# EAGLE schematic 8ChannelRebelSSR_v5 (EAGLE 9.6.2)
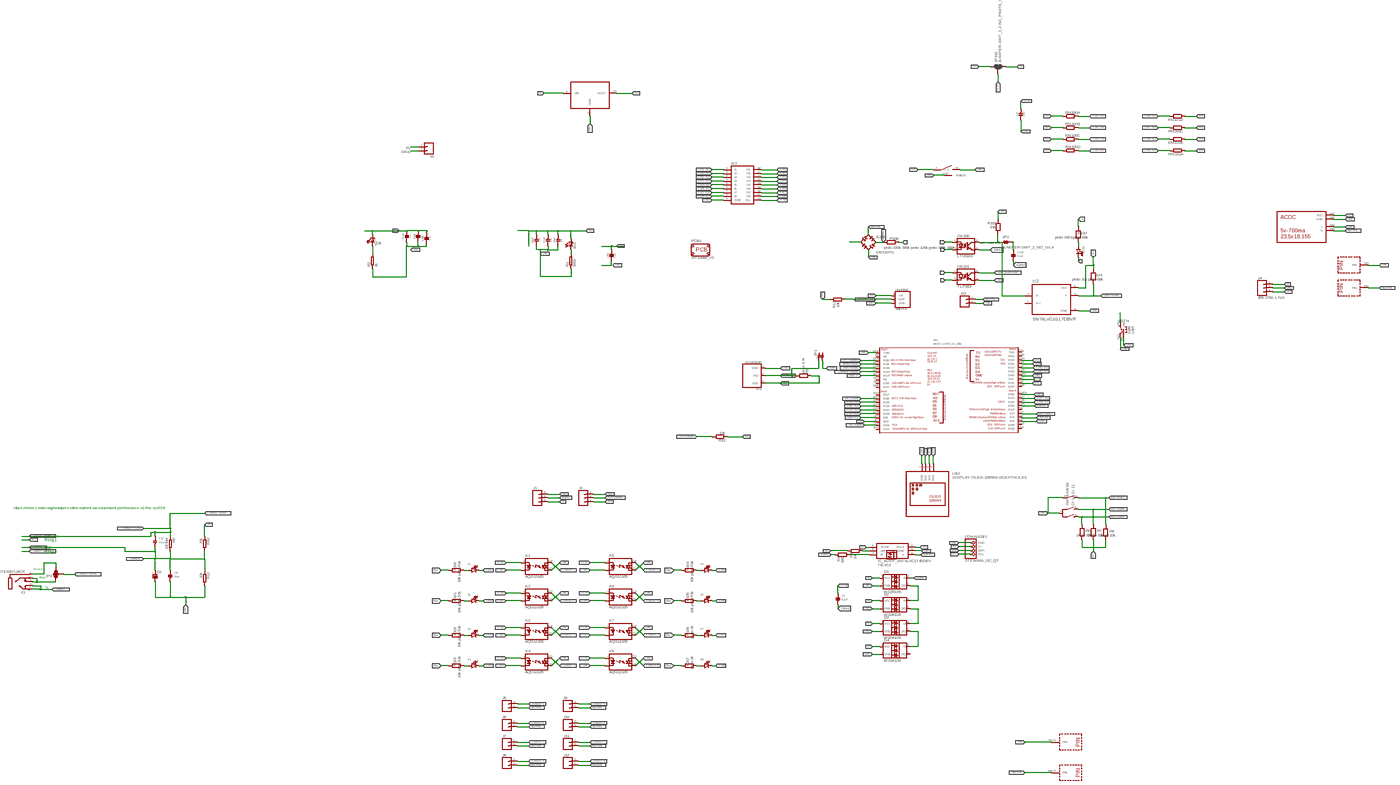
[diagram p0: schematic, sheet 1, overview]
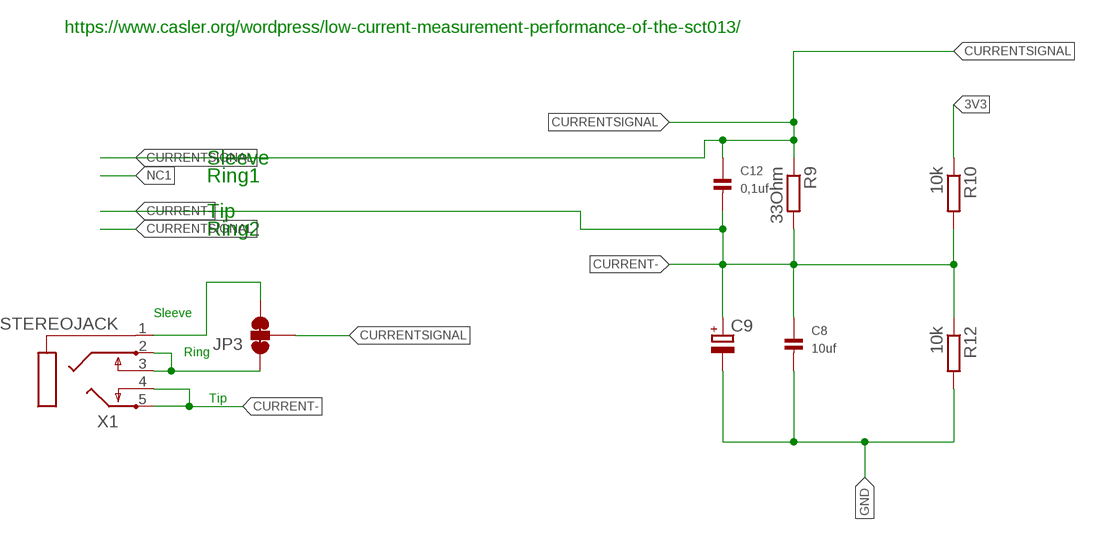
[diagram p1: schematic, sheet 1, part 1 of 4]
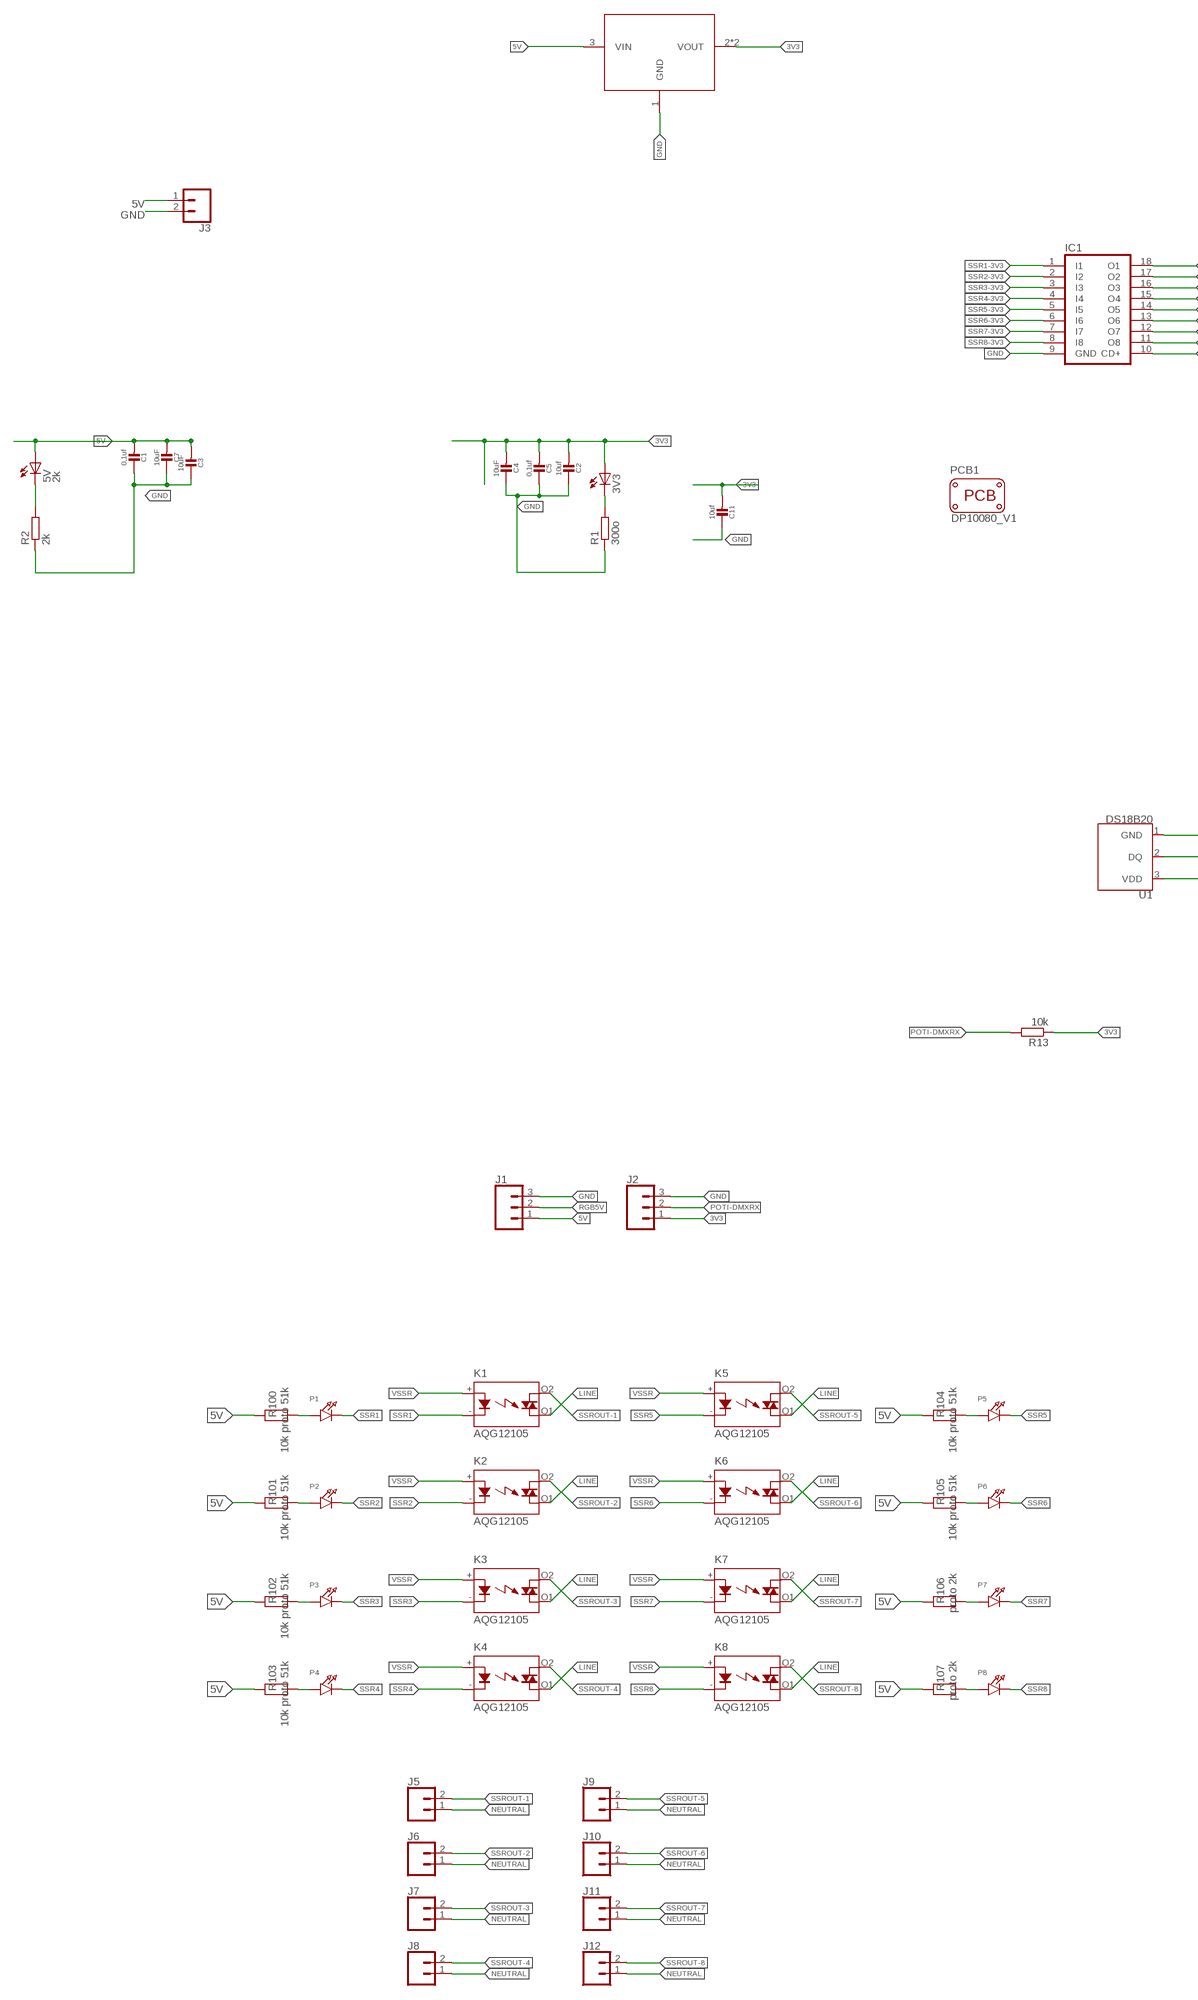
[diagram p2: schematic, sheet 1, part 2 of 4]
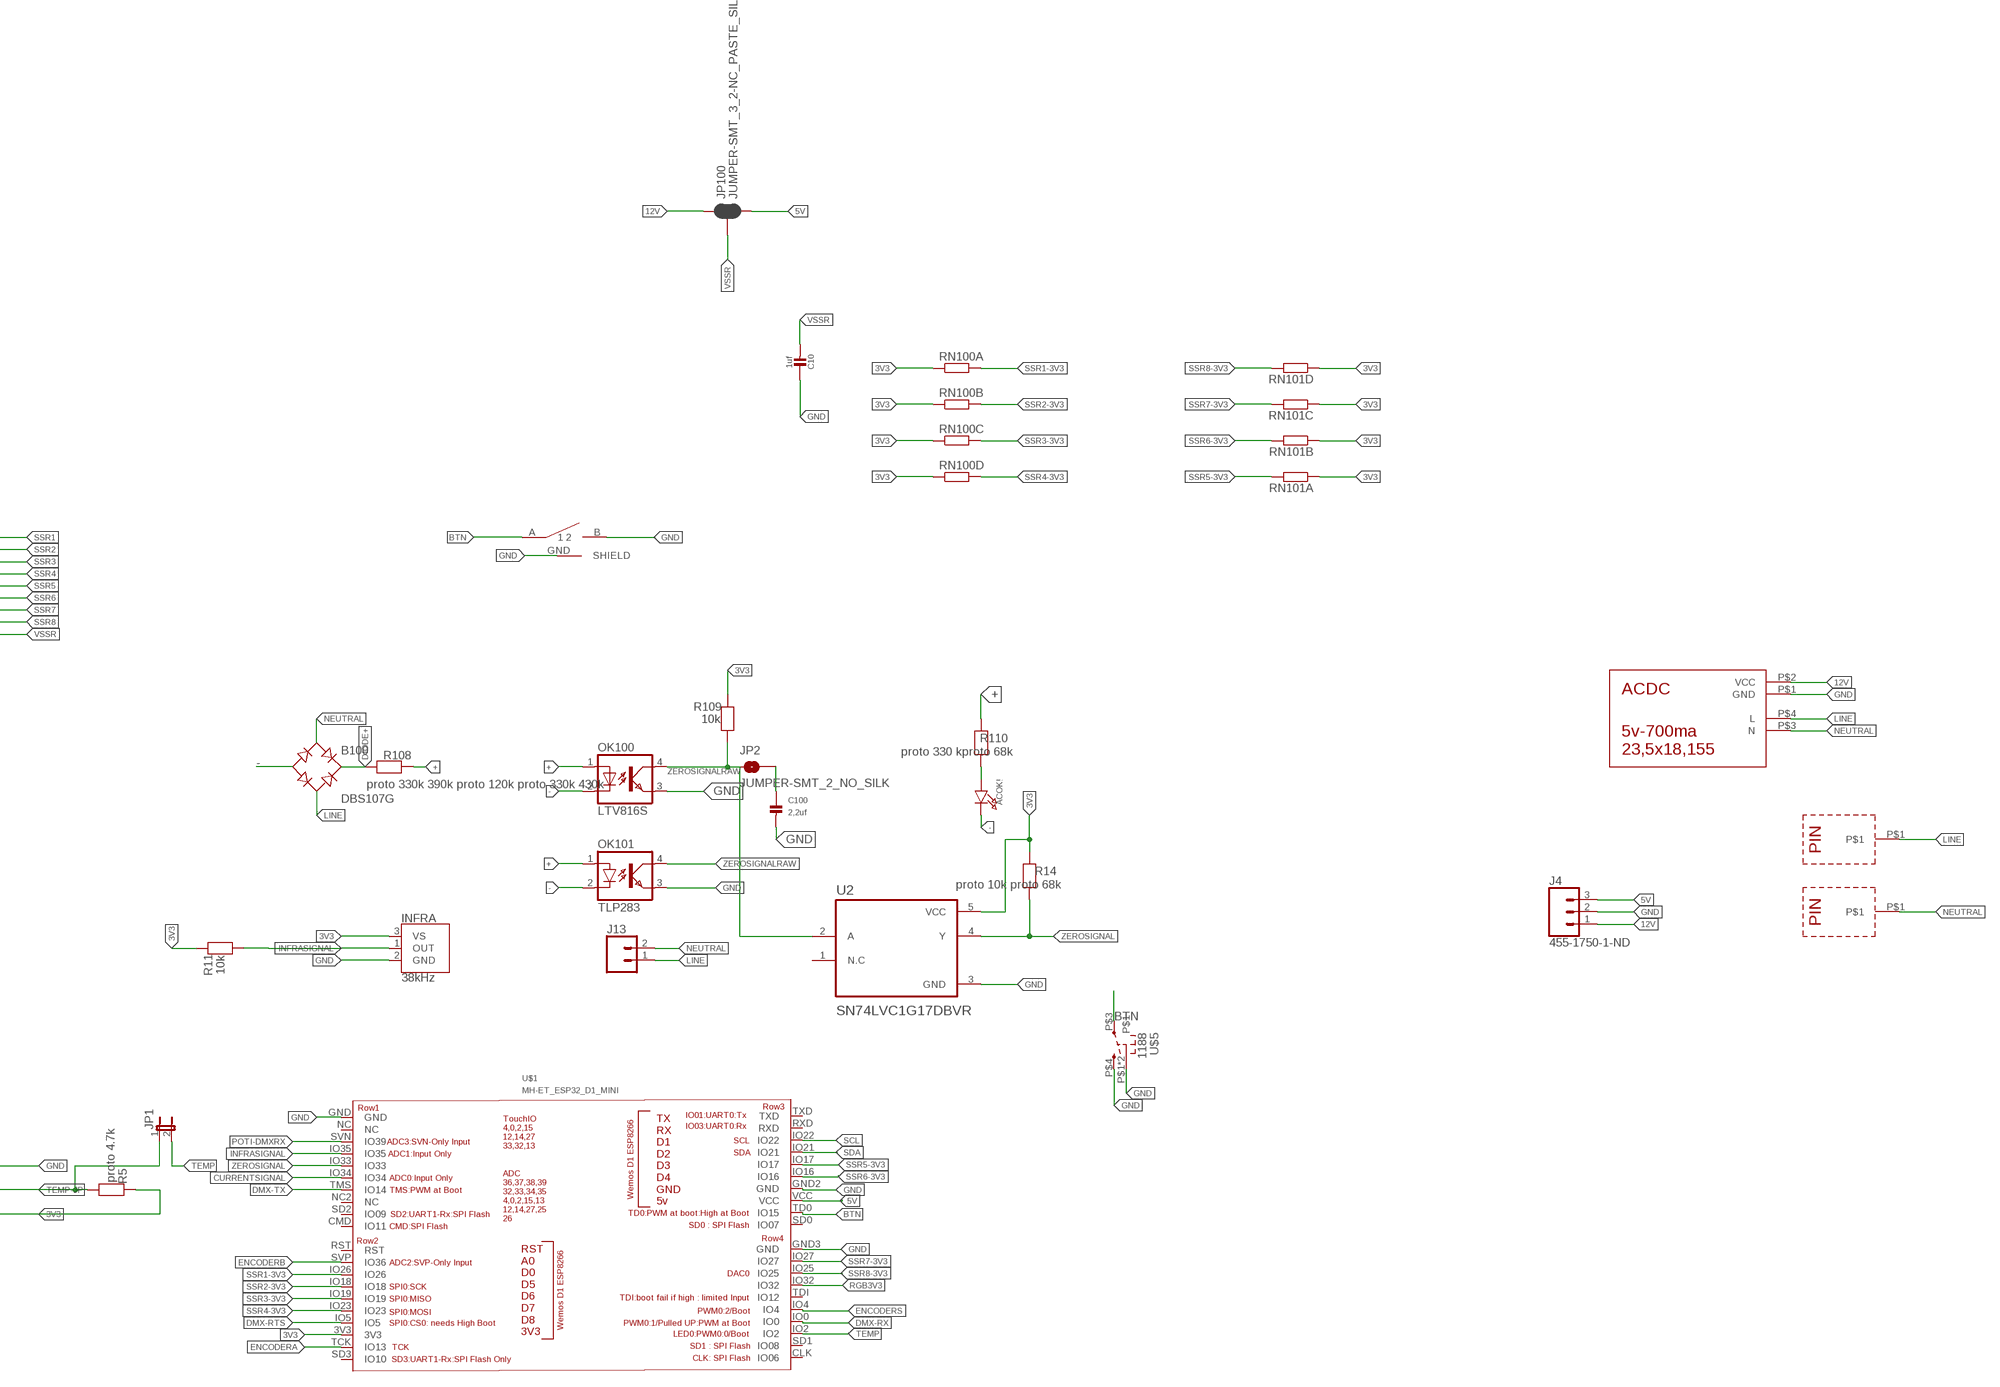
[diagram p3: schematic, sheet 1, part 3 of 4]
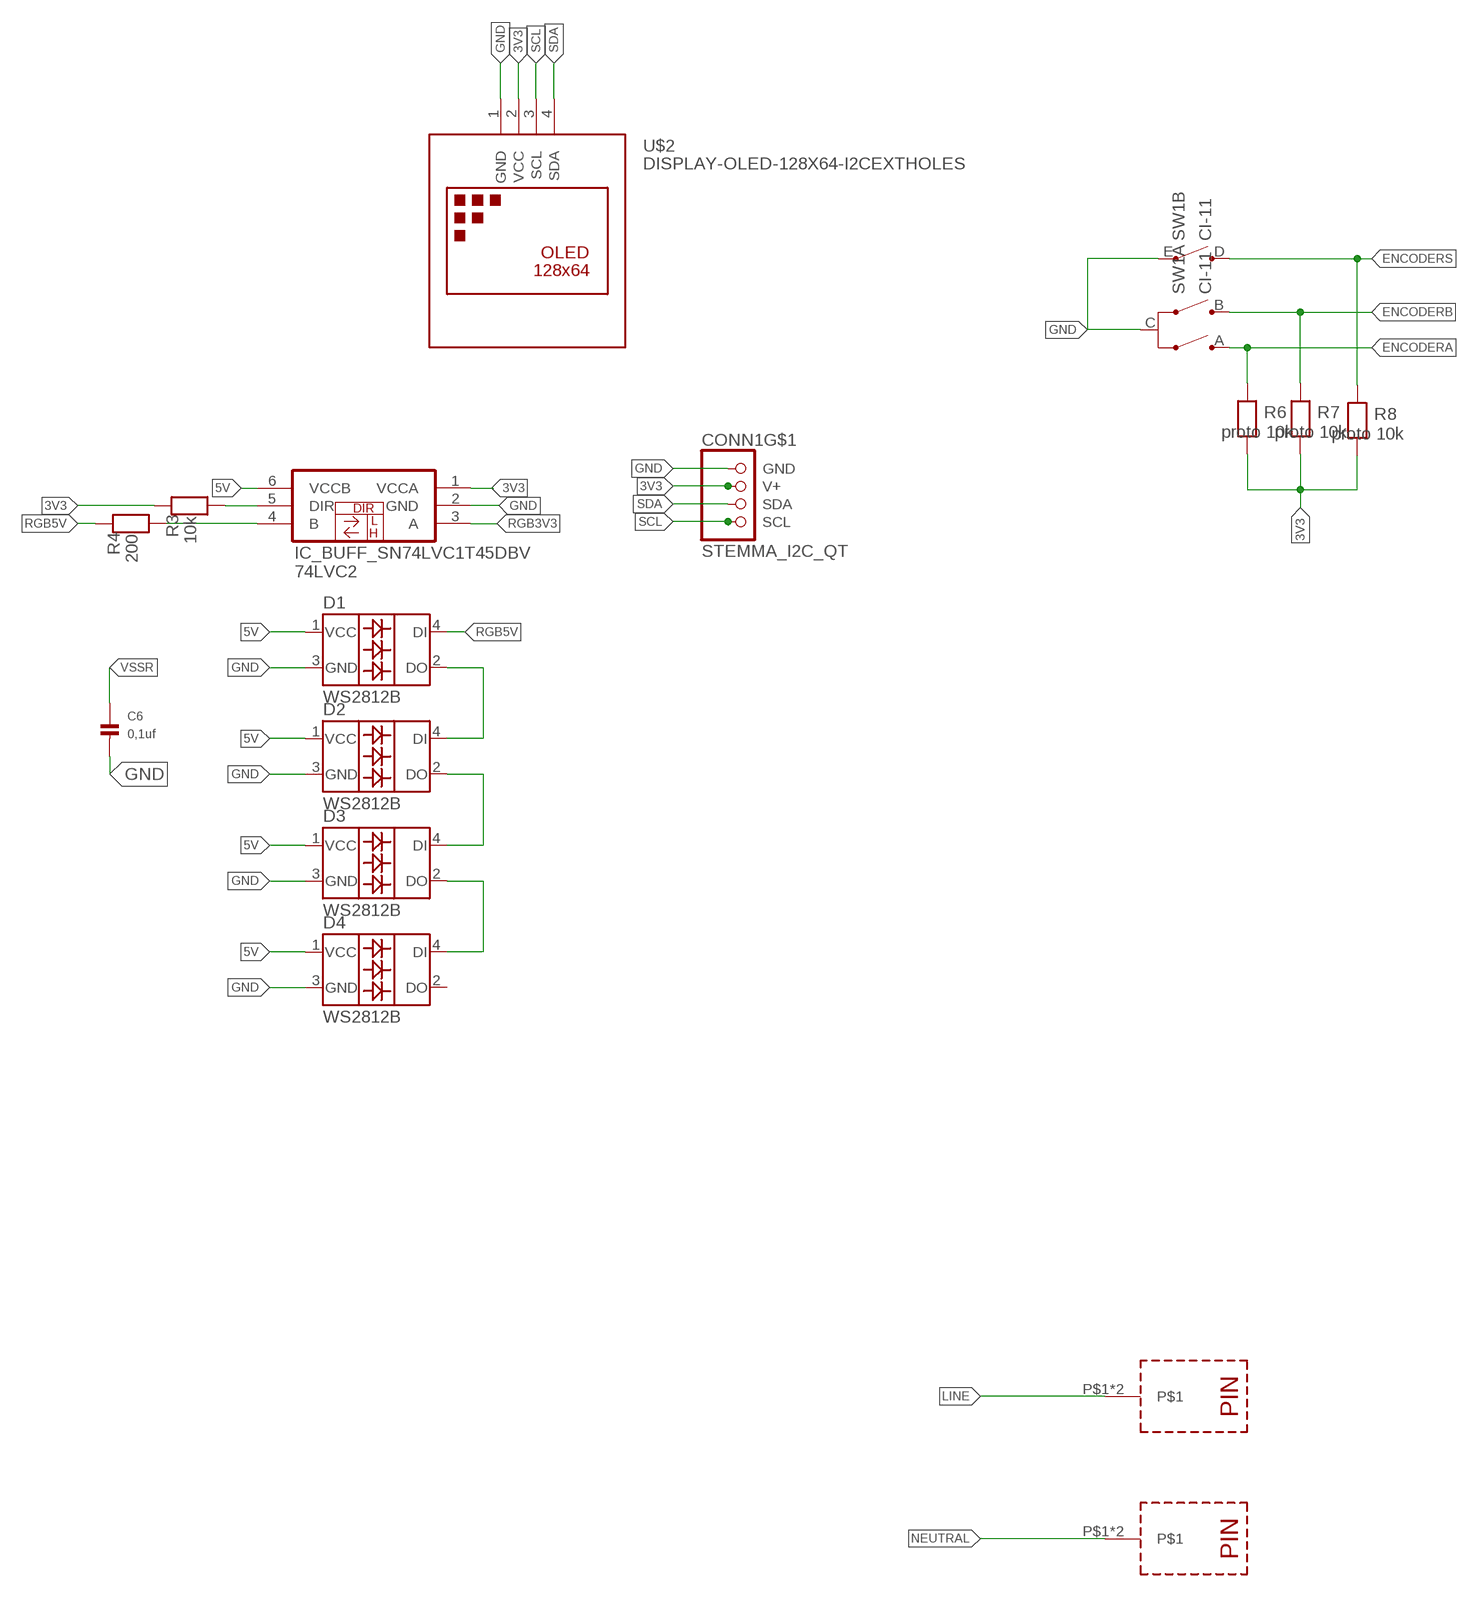
[diagram p4: schematic, sheet 1, part 4 of 4]

## Parts
3V3  LEDCHIPLED_0805  [CHIPLED_0805]
5V  2k  LEDCHIPLED_0805  [CHIPLED_0805]
74LVC2  IC_BUFF_SN74LVC1T45DBV  [DBV-R-PDSO-G6]
ACOK!  LED0805  [CHIPLED_0805]
B100  DBS107G  [DBS]
C1  0,1uf  CAP_CERAMIC0805-NOOUTLINE  [0805-NO]
C2  10uf  CAP_CERAMIC0805-NOOUTLINE  [0805-NO]
C3  10uF  CAP_CERAMIC0805-NOOUTLINE  [0805-NO]
C4  10uF  CAP_CERAMIC0805-NOOUTLINE  [0805-NO]
C5  0,1uf  CAP_CERAMIC0805-NOOUTLINE  [0805-NO]
C6  0,1uf  CAP_CERAMIC0805-NOTHERMALS  [0805_NOTHERMALS@1]
C7  10uF  CAP_CERAMIC0805-NOOUTLINE  [0805-NO]
C8  10uf  CAP_CERAMIC0805-NOTHERMALS  [0805_NOTHERMALS@1]
C9  CPOL-EUE1.8-4  [E1,8-4]
C10  1uf  CAP_CERAMIC0805-NOOUTLINE  [0805-NO]
C11  10uf  CAP_CERAMIC0805-NOOUTLINE  [0805-NO]
C12  0,1uf  CAP_CERAMIC0805-NOTHERMALS  [0805_NOTHERMALS@1]
C100  2,2uf  CAP_CERAMIC0805-NOTHERMALS  [0805_NOTHERMALS@1]
CONN1  STEMMA_I2C_QT  [JST_SH4]
D1  WS2812B  [WS2812B]
D2  WS2812B  [WS2812B]
D3  WS2812B  [WS2812B]
D4  WS2812B  [WS2812B]
IC1  IC_ULN2803ADW  [SO-18L]
INFRA  38kHz  TSOP38238  [TSOP382]
J1  CONN_03POLAR  [MOLEX-1X3]
J2  CONN_03POLAR  [MOLEX-1X3]
J3  CONN_02POLAR  [MOLEX-1X2]
J4  455-1750-1-ND  CONN_03  [1X03]
J5  CONN_023.5MM  [SCREWTERMINAL-3.5MM-2]
J6  CONN_023.5MM  [SCREWTERMINAL-3.5MM-2]
J7  CONN_023.5MM  [SCREWTERMINAL-3.5MM-2]
J8  CONN_023.5MM  [SCREWTERMINAL-3.5MM-2]
J9  CONN_023.5MM  [SCREWTERMINAL-3.5MM-2]
J10  CONN_023.5MM  [SCREWTERMINAL-3.5MM-2]
J11  CONN_023.5MM  [SCREWTERMINAL-3.5MM-2]
J12  CONN_023.5MM  [SCREWTERMINAL-3.5MM-2]
J13  CONN_023.5MM  [SCREWTERMINAL-3.5MM-2]
JP1  JUMPER2  [JUMPER2]
JP2  JUMPER-SMT_2_NO_SILK  [SMT-JUMPER_2_NO_SILK]
JP3  JUMPER-PAD-3-NC_BY_TRACE  [PAD-JUMPER-3-3OF3_NC_BY_TRACE_YES_SILK_FULL_BOX]
JP100  JUMPER-SMT_3_2-NC_PASTE_SILK  [SMT-JUMPER_3_2-NC_PASTE_SILK]
K1  AQG12105  [AQG]
K2  AQG12105  [AQG]
K3  AQG12105  [AQG]
K4  AQG12105  [AQG]
K5  AQG12105  [AQG]
K6  AQG12105  [AQG]
K7  AQG12105  [AQG]
K8  AQG12105  [AQG]
OK100  LTV816S  [DIL4-SMD]
OK101  TLP283  [MINI-FLAT-4]
P1  LED0805  [CHIPLED_0805]
P2  LED0805  [CHIPLED_0805]
P3  LED0805  [CHIPLED_0805]
P4  LED0805  [CHIPLED_0805]
P5  LED0805  [CHIPLED_0805]
P6  LED0805  [CHIPLED_0805]
P7  LED0805  [CHIPLED_0805]
P8  LED0805  [CHIPLED_0805]
PCB1  PCB_DP_RECTANGLE-80X100  [DP10080_V1]
R1  300o  RESISTORR805-0805  [R805]
R2  2k  RESISTORR805-0805  [R805]
R3  10k  RESISTOR0805  [0805@1]
R4  200  RESISTOR0805  [0805@1]
R5  proto 4.7k  RESISTOR0805  [0805@1]
R6  proto 10k  RESISTOR0805  [0805@1]
R7  proto 10k  RESISTOR0805  [0805@1]
R8  proto 10k  RESISTOR0805  [0805@1]
R9  33Ohm  RESISTORR805-0805  [R805]
R10  10k  RESISTORR805-0805  [R805]
R11  10k  RESISTOR0805  [0805@1]
R12  10k  RESISTORR805-0805  [R805]
R13  10k  RESISTORR805-0805  [R805]
R14  proto 10k proto 68k  RESISTOR0805  [0805@1]
R100  10k proto 51k  RESISTOR0805  [0805@1]
R101  10k proto 51k  RESISTOR0805  [0805@1]
R102  10k proto 51k  RESISTOR0805  [0805@1]
R103  10k proto 51k  RESISTOR0805  [0805@1]
R104  10k proto 51k  RESISTOR0805  [0805@1]
R105  10k proto 51k  RESISTOR0805  [0805@1]
R106  proto 2k  RESISTOR0805  [0805@1]
R107  proto 2k  RESISTOR0805  [0805@1]
R108  proto 330k 390k proto 120k proto 330k 430k  RESISTOR0805  [0805@1]
R109  10k  RESISTOR0805  [0805@1]
R110  proto 330 kproto 68k  RESISTOR0805  [0805@1]
RN100  RESISTOR_ARRAY_4  [RN8P-4R-CRA06S]
RN101  RESISTOR_ARRAY_4  [RN8P-4R-CRA06S]
SW1  CI-11  [CI-11]
U1  DS18B20  [TO-92-AMMO]
U2  SN74LVC1G17DBVR  [SOT95P280X145-5N]
U$1  MH-ET_ESP32_D1_MINI  [MH-ET_ESP32_D1_MINI]
U$2  DISPLAY-OLED-128X64-I2CEXTHOLES  [DISPLAY-OLED-128X64-MAX-I2C]
U$4  SWITCH4.5-4,5  [SWITCH4.5X4.5]
U$5  1188  [1188]
U$6  AP11173V3  [SOT223]
U$7  ACDC-SUPPLY  [ACDC-5V]
U$15  EST026_COLDPRESSTERMINAL  [EST026-COLDPRESSTERMINAL]
U$16  SCREWTERMINAL_BLOCL5X5_FLAT  [SCREWTERMINALFLAT5X5]
U$17  EST026_COLDPRESSTERMINAL  [EST026-COLDPRESSTERMINAL]
U$18  SCREWTERMINAL_BLOCL5X5_FLAT  [SCREWTERMINALFLAT5X5]
X1  STEREOJACK  [STX3100]

## Nets
3V3: 3V3.A 74LVC2.1(VCCA) C2.2 C4.2 C5.2 C11.2 CONN1.2(V+) INFRA.3(VS) J2.1 R3.2 R5.2 R6.1 R7.1 R8.1 R10.1 R11.2 R13.1 R14.2 R109.2 RN100.1 RN100.2 RN100.3 RN100.4 RN101.1 RN101.2 RN101.3 RN101.4 U1.3(VDD) U2.5(VCC) U$1.3V3 U$2.2(VCC) U$6.2(VOUT) U$6.4(VOUT)
5V: 5V.A 74LVC2.6(VCCB) C1.2 C3.2 C7.2 D1.1(VCC) D2.1(VCC) D3.1(VCC) D4.1(VCC) J1.1 J3.1 J4.3 JP100.3 R100.2 R101.2 R102.2 R103.2 R104.2 R105.2 R106.2 R107.2 U$1.VCC U$6.3(VIN)
12V: J4.1 JP100.1 U$7.P$2(VCC)
+: OK100.1(A) OK101.1(A) R108.2 R110.2
-: ACOK!.C B100.- OK100.2(C) OK101.2(C)
BTN: U$1.TD0(IO15) U$4.A U$5.P$3
CURRENT-: C8.1 C9.+ C12.2 R9.2 R10.2 R12.1 X1.4 X1.5
CURRENTSIGNAL: C12.1 JP3.2 R9.1 U$1.IO34
DIODE+: B100.+ R108.1
DMX-RTS: U$1.IO5
DMX-RX: U$1.IO0
DMX-TX: U$1.TMS(IO14)
ENCODERA: R6.2 SW1.A(A:A) U$1.TCK(IO13)
ENCODERB: R7.2 SW1.B(A:B) U$1.SVP(IO36)
ENCODERS: R8.2 SW1.D(B:D) U$1.IO4
GND: 74LVC2.2(GND) C1.1 C2.1 C3.1 C4.1 C5.1 C6.2 C7.1 C8.2 C9.- C10.1 C11.1 C100.2 CONN1.1(GND) D1.3(GND) D2.3(GND) D3.3(GND) D4.3(GND) IC1.9(GND) INFRA.2(GND) J1.3 J2.3 J3.2 J4.2 OK100.3(EMIT) OK101.3(EMIT) R1.1 R2.1 R12.2 SW1.C(A:C) SW1.E(B:E) U1.1(GND) U2.3(GND) U$1.GND U$1.GND2(GND) U$1.GND3(GND) U$2.1(GND) U$4.B U$4.GND(SHIELD) U$5.P$1 U$5.P$2 U$5.P$4 U$6.1(GND) U$7.P$1(GND)
INFRASIGNAL: INFRA.1(OUT) R11.1 U$1.IO35
LINE: B100.AC2 J13.1 K1.O1(DS2) K2.O1(DS2) K3.O1(DS2) K4.O1(DS2) K5.O1(DS2) K6.O1(DS2) K7.O1(DS2) K8.O1(DS2) U$7.P$4(L) U$15.P$1 U$15.P$2 U$16.P$1
N$1: C100.1 JP2.2
N$2: JP3.1 X1.2 X1.3
N$3: 74LVC2.5(DIR) R3.1
N$4: 74LVC2.4(B) R4.1
N$5: D1.2(DO) D2.4(DI)
N$6: D2.2(DO) D3.4(DI)
N$7: D3.2(DO) D4.4(DI)
N$8: ACOK!.A R110.1
N$9: 3V3.C R1.2
N$10: 5V.C R2.2
N$13: P4.A R103.1
N$14: P3.A R102.1
N$16: P2.A R101.1
N$17: P1.A R100.1
N$18: P8.A R107.1
N$19: P7.A R106.1
N$20: P6.A R105.1
N$21: P5.A R104.1
NEUTRAL: B100.AC1 J5.1 J6.1 J7.1 J8.1 J9.1 J10.1 J11.1 J12.1 J13.2 U$7.P$3(N) U$17.P$1 U$17.P$2 U$18.P$1
OLDSIGNAL1: JP3.3 X1.1
POTI-DMXRX: J2.2 R13.2 U$1.SVN(IO39)
RGB3V3: 74LVC2.3(A) U$1.IO32
RGB5V: D1.4(DI) J1.2 R4.2
SCL: CONN1.4(SCL) U$1.IO22 U$2.3(SCL)
SDA: CONN1.3(SDA) U$1.IO21 U$2.4(SDA)
SSR1: IC1.18(O1) K1.-(K) P1.C
SSR1-3V3: IC1.1(I1) RN100.8 U$1.IO26
SSR2: IC1.17(O2) K2.-(K) P2.C
SSR2-3V3: IC1.2(I2) RN100.7 U$1.IO18
SSR3: IC1.16(O3) K3.-(K) P3.C
SSR3-3V3: IC1.3(I3) RN100.6 U$1.IO19
SSR4: IC1.15(O4) K4.-(K) P4.C
SSR4-3V3: IC1.4(I4) RN100.5 U$1.IO23
SSR5: IC1.14(O5) K5.-(K) P5.C
SSR5-3V3: IC1.5(I5) RN101.8 U$1.IO17
SSR6: IC1.13(O6) K6.-(K) P6.C
SSR6-3V3: IC1.6(I6) RN101.7 U$1.IO16
SSR7: IC1.12(O7) K7.-(K) P7.C
SSR7-3V3: IC1.7(I7) RN101.6 U$1.IO27
SSR8: IC1.11(O8) K8.-(K) P8.C
SSR8-3V3: IC1.8(I8) RN101.5 U$1.IO25
SSROUT-1: J5.2 K1.O2(DS1)
SSROUT-2: J6.2 K2.O2(DS1)
SSROUT-3: J7.2 K3.O2(DS1)
SSROUT-4: J8.2 K4.O2(DS1)
SSROUT-5: J9.2 K5.O2(DS1)
SSROUT-6: J10.2 K6.O2(DS1)
SSROUT-7: J11.2 K7.O2(DS1)
SSROUT-8: J12.2 K8.O2(DS1)
TEMP: JP1.2 U$1.IO2
TEMP-JP: JP1.1 R5.1 U1.2(DQ)
VSSR: C6.1 C10.2 IC1.10(CD+) JP100.2 K1.+(A) K2.+(A) K3.+(A) K4.+(A) K5.+(A) K6.+(A) K7.+(A) K8.+(A)
ZEROSIGNAL: R14.1 U2.4(Y) U$1.IO33
ZEROSIGNALRAW: JP2.1 OK100.4(COL) OK101.4(COL) R109.1 U2.2(A)
Unconnected: CONN1.MT1(MT) CONN1.MT2(MT) D4.2(DO) U2.1(N.C) U$1.CLK(IO06) U$1.CMD(IO11) U$1.NC U$1.NC2(NC) U$1.RST U$1.RXD U$1.SD0(IO07) U$1.SD1(IO08) U$1.SD2(IO09) U$1.SD3(IO10) U$1.TDI(IO12) U$1.TXD

## Notes on the sheet
- https://www.casler.org/wordpress/low-current-measurement-performance-of-the-sct013/
- Sleeve
- Ring1
- Tip
- Ring2
- Sleeve
- Ring
- Tip

## Library data of the parts
3V3 5V = adafruit:LED: LED
74LVC2 = dp_devices:IC_BUFF_SN74LVC1T45DBV
ACOK! P1-P8 = microbuilder:LED: LED
B100 = rectifier:DB?*G: Single Phase 1.0 AMP Glass Passivated Bridge Rectifier Taiwan Semiconductor Co.,Ltd. - TSC Source: http://www.taiwansemi.com/TSCbig5/ezcatfiles/cust/img/img/db101g.pdf http://www.ts.com.tw/db/pictures/modules/PDT/PDT060207001/DBLS201G.pdf
C1-C8 C10-C12 C100 = microbuilder:CAP_CERAMIC: Ceramic Capacitors For new designs, use the packages preceded by an '_' character since they are more reliable: The following footprints should be used on most boards: _0402 - Standard footprint for regular board layouts _0603 - Standard footprint for regular board layouts _0805 - Standard footprint for regular board layouts _1206 - Standard footprint for regular board layouts For extremely tight-pitch boards where space is at a premium, the following 'micro-pitch' footprints can be used (smaller pads, no silkscreen outline, etc.): _0402MP - Micro-pitch footprint for very dense/compact boards _0603MP - Micro-pitch footprint for very dense/compact boards _0805MP - Micro-pitch footprint for very dense/compact boards _1206MP - Micro-pitch footprint for very dense/compact boards
C9 = rcl:CPOL-EU: POLARIZED CAPACITOR, European symbol; SPICEPREFIX: C
CONN1 = microbuilder:STEMMA_I2C
D1-D4 = we-opto:WS2812B: WS2812 RGB LED (built-in driver)
IC1 = dp_devices:IC_ULN2803A: DRIVER ARRAY
INFRA = SparkFun-Sensors:TSOP382: Vishay Semiconductor TSOP32838 - 38kHz IR Receiver These products are miniaturized IR receiver modules for infrared remote control systems. A PIN diode and a preamplifier are assembled on a leadframe, the epoxy package contains an IR filter. The demodulated output signal can be directly connected to a microprocessor for decoding.; PROD_ID: SEN-14114
J1 J2 = SparkFun-Connectors:CONN_03: Multi connection point. Often used as Generic Header-pin footprint for 0.1 inch spaced/style header connections On any of the 0.1 inch spaced packages, you can populate with these: Break Away Headers - Straight <https://www.sparkfun.com/products/116> (PRT-00116) Break Away Male Headers - Right Angle <https://www.sparkfun.com/products/553> (PRT-00553) Female Headers <https://www.sparkfun.com/products/115> (PRT-00115) Break Away Headers - Machine Pin <https://www.sparkfun.com/products/117> (PRT-00117) Break Away Female Headers - Swiss Machine Pin <https://www.sparkfun.com/products/743> (PRT-00743) Stackable Header - 3 Pin (Female, 0.1") <https://www.sparkfun.com/products/13875> (PRT-13875) For SCREWTERMINALS and SPRING TERMINALS visit here: Screw Terimnals on SparkFun.com <https://www.sparkfun.com/search/results?term=Screw+Terminals> (5mm/3.5mm/2.54mm spacing) This device is also useful as a general connection point to wire up your design to another part of your project. Our various solder wires solder well into these plated through hole pads. Hook-Up Wire - Assortment (Stranded, 22 AWG) <https://www.sparkfun.com/products/11375> (PRT-11375) Hook-Up Wire - Assortment (Solid Core, 22 AWG) <https://www.sparkfun.com/products/11367> (PRT-11367) View the entire wire category on our website here <https://www.sparkfun.com/categories/141> Special notes: Molex polarized connector foot print use with SKU : PRT-08232 with associated crimp pins and housings.; PROD_ID: CONN-08625; SF_ID: PRT-08096
J3 = SparkFun-Connectors:CONN_02: Multi connection point. Often used as Generic Header-pin footprint for 0.1 inch spaced/style header connections On any of the 0.1 inch spaced packages, you can populate with these: Break Away Headers - Straight <https://www.sparkfun.com/products/116> (PRT-00116) Break Away Male Headers - Right Angle <https://www.sparkfun.com/products/553> (PRT-00553) Female Headers <https://www.sparkfun.com/products/115> (PRT-00115) Break Away Headers - Machine Pin <https://www.sparkfun.com/products/117> (PRT-00117) Break Away Female Headers - Swiss Machine Pin <https://www.sparkfun.com/products/743> (PRT-00743) For SCREWTERMINALS and SPRING TERMINALS visit here: Screw Terimnals on SparkFun.com <https://www.sparkfun.com/search/results?term=Screw+Terminals> (5mm/3.5mm/2.54mm spacing) This device is also useful as a general connection point to wire up your design to another part of your project. Our various solder wires solder well into these plated through hole pads. Hook-Up Wire - Assortment (Stranded, 22 AWG) <https://www.sparkfun.com/products/11375> (PRT-11375) Hook-Up Wire - Assortment (Solid Core, 22 AWG) <https://www.sparkfun.com/products/11367> (PRT-11367) View the entire wire category on our website here <https://www.sparkfun.com/categories/141> Special notes: Molex polarized connector foot print use with: PRT-08233 with associated crimp pins and housings. 2.54_SCREWTERM for use with PRT-10571. 3.5mm Screw Terminal footprints for PRT-08084 5mm Screw Terminal footprints for use with PRT-08432; SF_ID: PRT-09918
J4 = SparkFun-Connectors:CONN_03: Multi connection point. Often used as Generic Header-pin footprint for 0.1 inch spaced/style header connections On any of the 0.1 inch spaced packages, you can populate with these: Break Away Headers - Straight <https://www.sparkfun.com/products/116> (PRT-00116) Break Away Male Headers - Right Angle <https://www.sparkfun.com/products/553> (PRT-00553) Female Headers <https://www.sparkfun.com/products/115> (PRT-00115) Break Away Headers - Machine Pin <https://www.sparkfun.com/products/117> (PRT-00117) Break Away Female Headers - Swiss Machine Pin <https://www.sparkfun.com/products/743> (PRT-00743) Stackable Header - 3 Pin (Female, 0.1") <https://www.sparkfun.com/products/13875> (PRT-13875) For SCREWTERMINALS and SPRING TERMINALS visit here: Screw Terimnals on SparkFun.com <https://www.sparkfun.com/search/results?term=Screw+Terminals> (5mm/3.5mm/2.54mm spacing) This device is also useful as a general connection point to wire up your design to another part of your project. Our various solder wires solder well into these plated through hole pads. Hook-Up Wire - Assortment (Stranded, 22 AWG) <https://www.sparkfun.com/products/11375> (PRT-11375) Hook-Up Wire - Assortment (Solid Core, 22 AWG) <https://www.sparkfun.com/products/11367> (PRT-11367) View the entire wire category on our website here <https://www.sparkfun.com/categories/141> Special notes: Molex polarized connector foot print use with SKU : PRT-08232 with associated crimp pins and housings.; PROD_ID: XXX-00000
J5-J13 = SparkFun-Connectors:CONN_02: Multi connection point. Often used as Generic Header-pin footprint for 0.1 inch spaced/style header connections On any of the 0.1 inch spaced packages, you can populate with these: Break Away Headers - Straight <https://www.sparkfun.com/products/116> (PRT-00116) Break Away Male Headers - Right Angle <https://www.sparkfun.com/products/553> (PRT-00553) Female Headers <https://www.sparkfun.com/products/115> (PRT-00115) Break Away Headers - Machine Pin <https://www.sparkfun.com/products/117> (PRT-00117) Break Away Female Headers - Swiss Machine Pin <https://www.sparkfun.com/products/743> (PRT-00743) For SCREWTERMINALS and SPRING TERMINALS visit here: Screw Terimnals on SparkFun.com <https://www.sparkfun.com/search/results?term=Screw+Terminals> (5mm/3.5mm/2.54mm spacing) This device is also useful as a general connection point to wire up your design to another part of your project. Our various solder wires solder well into these plated through hole pads. Hook-Up Wire - Assortment (Stranded, 22 AWG) <https://www.sparkfun.com/products/11375> (PRT-11375) Hook-Up Wire - Assortment (Solid Core, 22 AWG) <https://www.sparkfun.com/products/11367> (PRT-11367) View the entire wire category on our website here <https://www.sparkfun.com/categories/141> Special notes: Molex polarized connector foot print use with: PRT-08233 with associated crimp pins and housings. 2.54_SCREWTERM for use with PRT-10571. 3.5mm Screw Terminal footprints for PRT-08084 5mm Screw Terminal footprints for use with PRT-08432; PROD_ID: CONN-08399
JP1 = microbuilder:JUMPER2: JUMPER - 2 Pins
JP2 = SparkFun-Jumpers:JUMPER-SMT_2_NO: Normally open jumper This jumper has two pads in close proximity to each other. Apply solder to close the connection. Round pads are easier to solder for beginners, but are a lot larger. SparkFun Product that uses the round pads: SparkFun EL Sequencer <https://www.sparkfun.com/products/12781>
JP3 = Explore Labs EAGLE Library:JUMPER-PAD-3-NC_BY_TRACE
JP100 = SparkFun-Jumpers:JUMPER-SMT_3_2-NC_PASTE: Normally closed solder jumper (2 of 2 connections) This jumper has an aperture in the stencil to allow solder paste to bridge both connections. Both connections are normally closed (NC). Wick off the solder to open the connection(s). Reapply solder to reclose the connection(s).
K1-K8 = relay:AQG*: SOLID STATE RELAY NAiS Zero-cross, Non zero-cross Source: http://www.mew-europe.com/.. en_ds_61611_0000.pdf; MF: AROMAT/ MATSUSHITA; MPN: AQG12105; OC_FARNELL: unknown; OC_NEWARK: 20J4759
OK100 = optocoupler:LTV816: OPTO COUPLER Source: LITEON, LTV816.pdf
OK101 = optocoupler:TLP283: TOSHIBA PHOTOCOUPLER GaAs IRED & PHOTO-TRANSISTOR Source: http://www.semicon.toshiba.co.jp/td/en/Opto/Photocoupler/en_20050928_TLP283_datasheet.pdf; OC_FARNELL: unknown; OC_NEWARK: unknown
PCB1 = dp_devices:PCB_DP_RECTANGLE: Dangerous Prototypes Standard Rectangular PCB sizes; PCB_SIZE: DP10080_V1
R1 R2 R9 R10 R12 R13 = dp_devices:RESISTOR
R3-R8 R11 R14 R100-R110 = microbuilder:RESISTOR: Resistors 0402 - 0402 Surface Mount Package 22 Ohm 1% 1/16W [Digikey: 311-22.0LRTR-ND] 33 Ohm 5% 1/16W 1.0K 5% 1/16W 1.5K 5% 1/16W 2.0K 1% 1/16W 10.0K 1% 1/16W [Digikey: 311-10.0KLRTR-ND] 10.0K 5% 1/16W [Digikey: RMCF0402JT10K0TR-ND] 12.1K 1% 1/16W [Digikey: 311-22.0LRTR-ND] 100.0K 5% 1/16W 0603 - 0603 Surface Mount Package 0 Ohm 1/10 Watt 1% Resistor 15 Ohm 1/10 Watt 1% Resistor 33 Ohm 1/10 Watt 1% Resistor 49.9 Ohm 1/10 Watt 1% Resistor 100 Ohm 1/10 Watt 1% Resistor 150 Ohm 1/10 Watt 1% Resistor 240 Ohm 1/10 Watt 1% Resistor 390 Ohm 1/10 Watt 1% Resistor 560 Ohm 1/10 Watt 1% Resistor 680 Ohm 1/10 Watt 1% Resistor 750 Ohm 1/10 Watt 1% Resistor 1.0K Ohm 1/10 Watt 1% Resistor 1.5K Ohm 1/10 Watt 1% Resistor 2.0K Ohm 1/10 Watt 1% Resistor 2.2K Ohm 1/10 Watt 1% Resistor 3.3K Ohm 1/10 Watt 1% Resistor 4.7K Ohm 1/10 Watt 1% Resistor 10.0K Ohm 1/10 Watt 1% Resistor 12.0K Ohm 1/10 Watt 1% Resistor 12.1K Ohm 1/10 Watt 1% Resistor 20.0K Ohm 1/10 Watt 1% Resistor 33.0K Ohm 1/10 Watt 1% Resistor 100.0K Ohm 1/10 Watt 1% Resistor 0805 - 0805 Surface Mount Package 0 Ohm 1/8 Watt 1% Resistor 33 Ohm 1/8 Watt 1% Resistor 100 Ohm 1/8 Watt 1% Resistor 150 Ohm 1/8 Watt 1% Resistor 200 Ohm 1/8 Watt 1% Resistor 240 Ohm 1/8 Watt 1% Resistor 330 Ohm 1/8 Watt 1% Resistor 390 Ohm 1/8 Watt 1% Resistor 470 Ohm 1/8 Watt 1% Resistor 1.0K Ohm 1/8 Watt 1% Resistor 1.5K Ohm 1/8 Watt 1% Resistor 2.0K Ohm 1/8 Watt 1% Resistor 4.7K Ohm 1/8 Watt 1% Resistor 5.1K Ohm 1/8 Watt 1% Resistor 5.6K Ohm 1/8 Watt 1% Resistor 10.0K Ohm 1/8 Watt 1% Resistor 22.0K Ohm 1/8 Watt 1% Resistor 33.0K Ohm 1/8 Watt 1% Resistor 100K Ohm 1/8 Watt 1% Resistor 1206 - 1206 Surface Mount Package 2012 - 2010 Surface Mount Package 0.11 Ohm 1/2 Watt 1% Resistor - Digikey: RHM.11UCT-ND
RN100 RN101 = dp_devices:RESISTOR_ARRAY_4: 4 Resistor Array 0603
SW1 = piher:CI-11: 11mm Incemental Encoder Source: www.piher.net .. 04-CI-11v04.pdf; OC_FARNELL: unknown; OC_NEWARK: unknown
U1 = SparkFun-Sensors:DS18B20: Dallas/Maxim DS18B20 1-Wire Temperature Sensor The DS18B20 reports degrees C with 9 to 12-bit precision, -55C to 125C (+/-0.5C). Each sensor has a unique 64-Bit Serial number etched into it - allows for a huge number of sensors to be used on one data bus. Datasheet <http://datasheets.maximintegrated.com/en/ds/DS18B20.pdf> SparkFun Products One Wire Digital Temperature Sensor - DS18B20 <https://www.sparkfun.com/products/245> (SEN-00245); STORE_ID: SEN-00245
U2 = SN74LVC1G17DBVR:SN74LVC1G17DBVR: Check availability <https://pricing.snapeda.com/parts/SN74LVC1G17DBVR/Texas%20Instruments/view-part?ref=eda>; AVAILABILITY: In Stock; DESCRIPTION: Single 1.65-V to 5.5-V buffer with Schmitt-Trigger inputs; MF: Texas Instruments; MP: SN74LVC1G17DBVR; PACKAGE: SOT-23-5 Texas Instruments; PRICE: None; PURCHASE-URL: https://pricing.snapeda.com/search?q=SN74LVC1G17DBVR&ref=eda
U$1 = MH-ET_ESP32_D1_MINI:MH-ET_ESP32_D1_MINI
U$2 = diy-modules:DISPLAY-OLED-128X64-I2C: 128x64 Dot Matrix OLED Module based on SSD1306 chip Variant with I2C interface More details available here: http://www.instructables.com/id/Monochrome-096-i2c-OLED-display-with-arduino-SSD13/ SSD1306 datasheet: https://cdn-shop.adafruit.com/datasheets/SSD1306.pdf Click here to find device on ebay.com <http://www.ebay.com/sch/oled+display+128x64+iic> Note: There are two variants: I2C and SPI. Search for the proper version.
U$4 = MyBreadBoards:SWITCH4.5-4,5
U$5 = SwitchMax:1188
U$6 = gee_s:AP11173V3
U$7 = MyBreadBoards:ACDC-SUPPLY
U$15 U$17 = MyBreadBoards:EST026_COLDPRESSTERMINAL
U$16 U$18 = MyBreadBoards:SCREWTERMINAL_BLOCL5X5_FLAT
X1 = adafruit:STEREOJACK: MIC/HEADPHONE JACK Stereo jack with two switches. Kycon STX3100, CUI SJ1-3555NG and/or 4UCon 05544

## Net classes
3 12_mil: width 0.305 mm